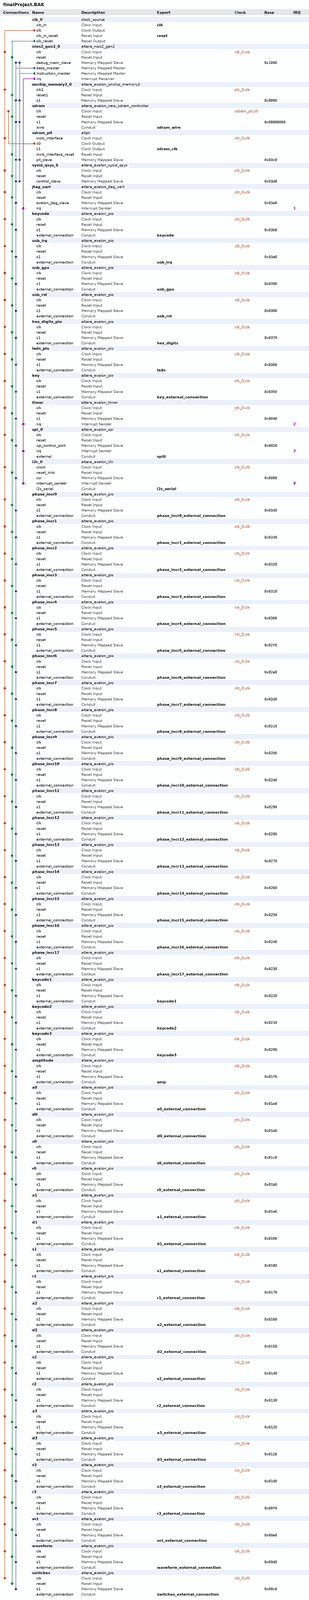
[diagram p0: system contents, whole]
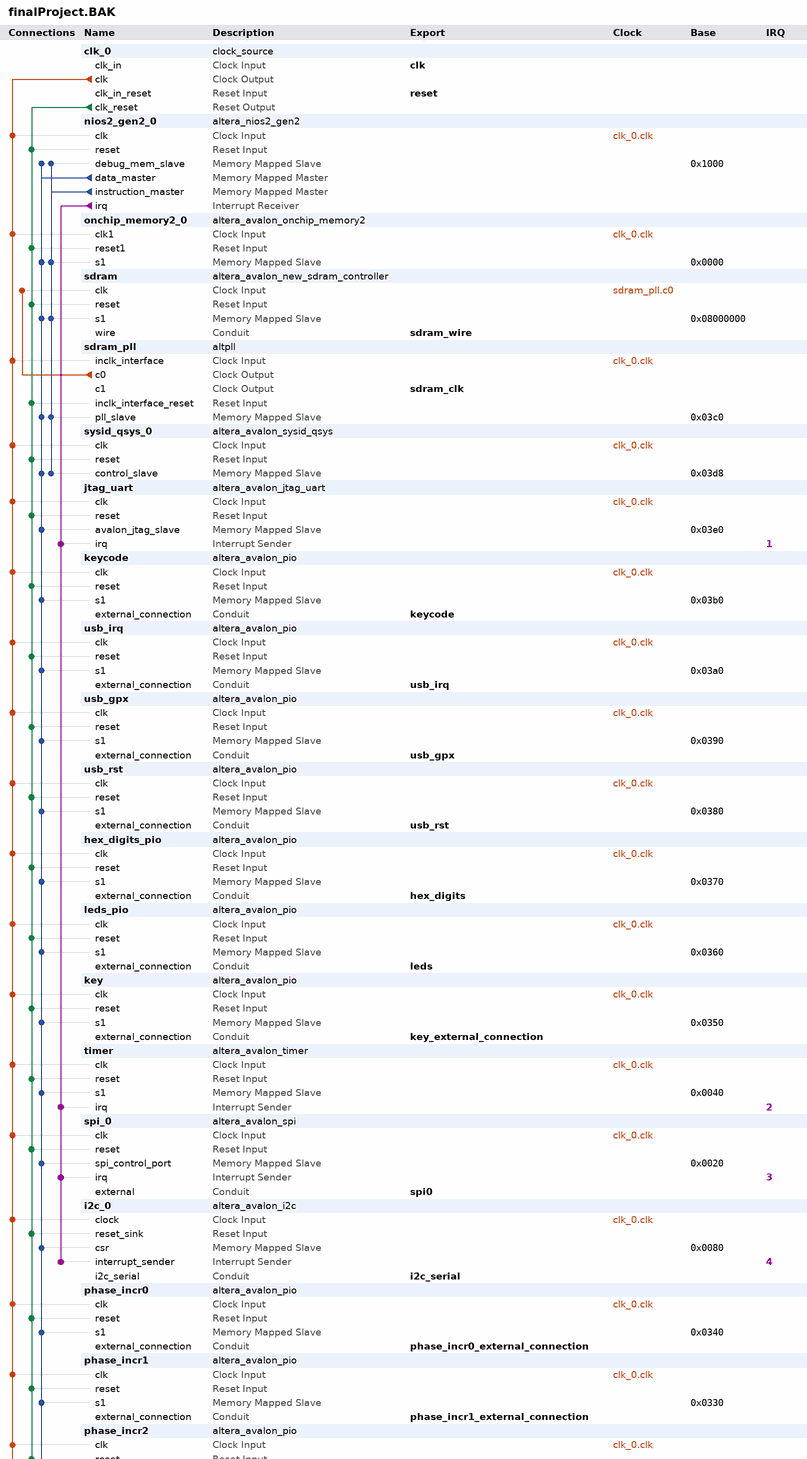
[diagram p1: system contents, upper part]
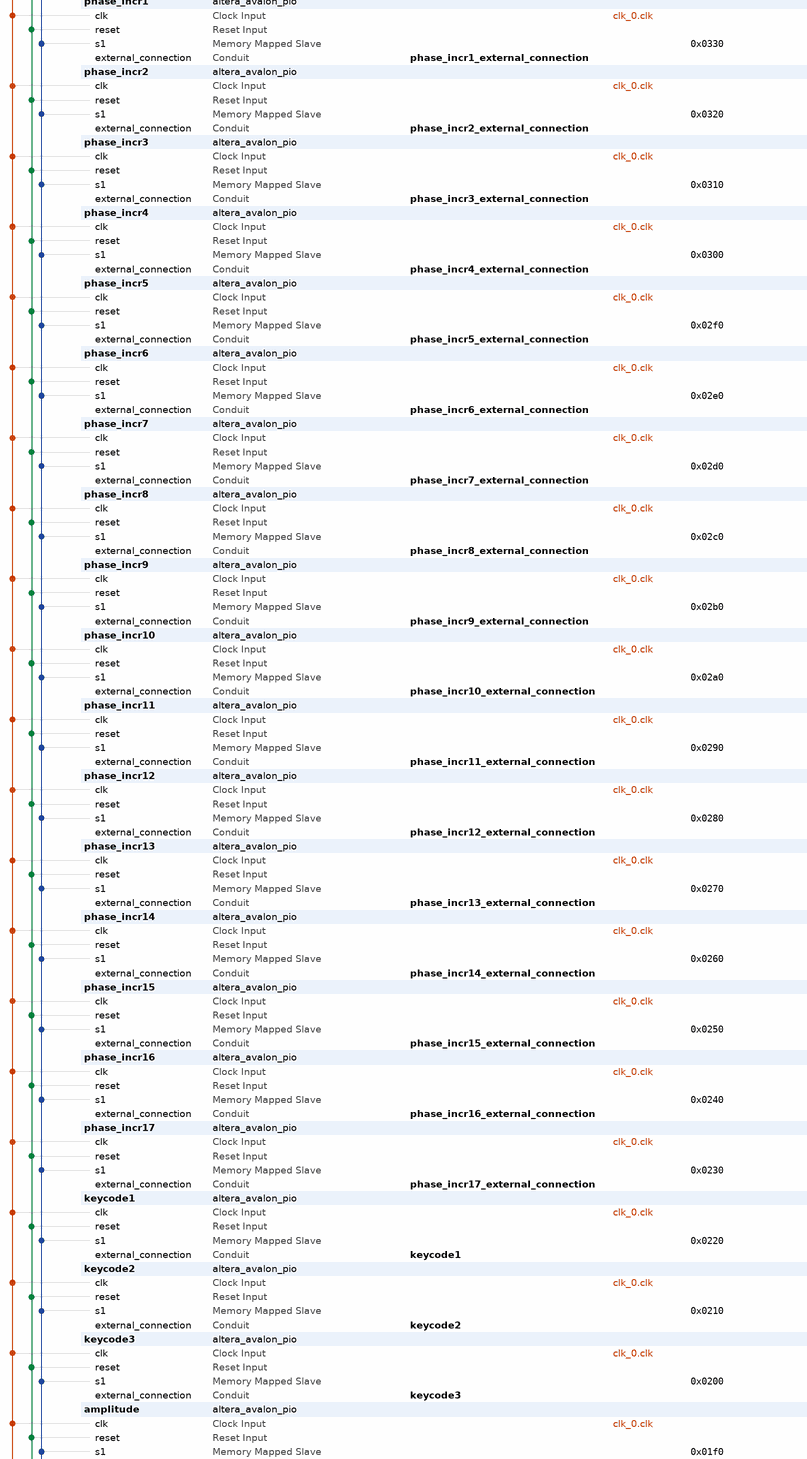
[diagram p2: system contents, middle part]
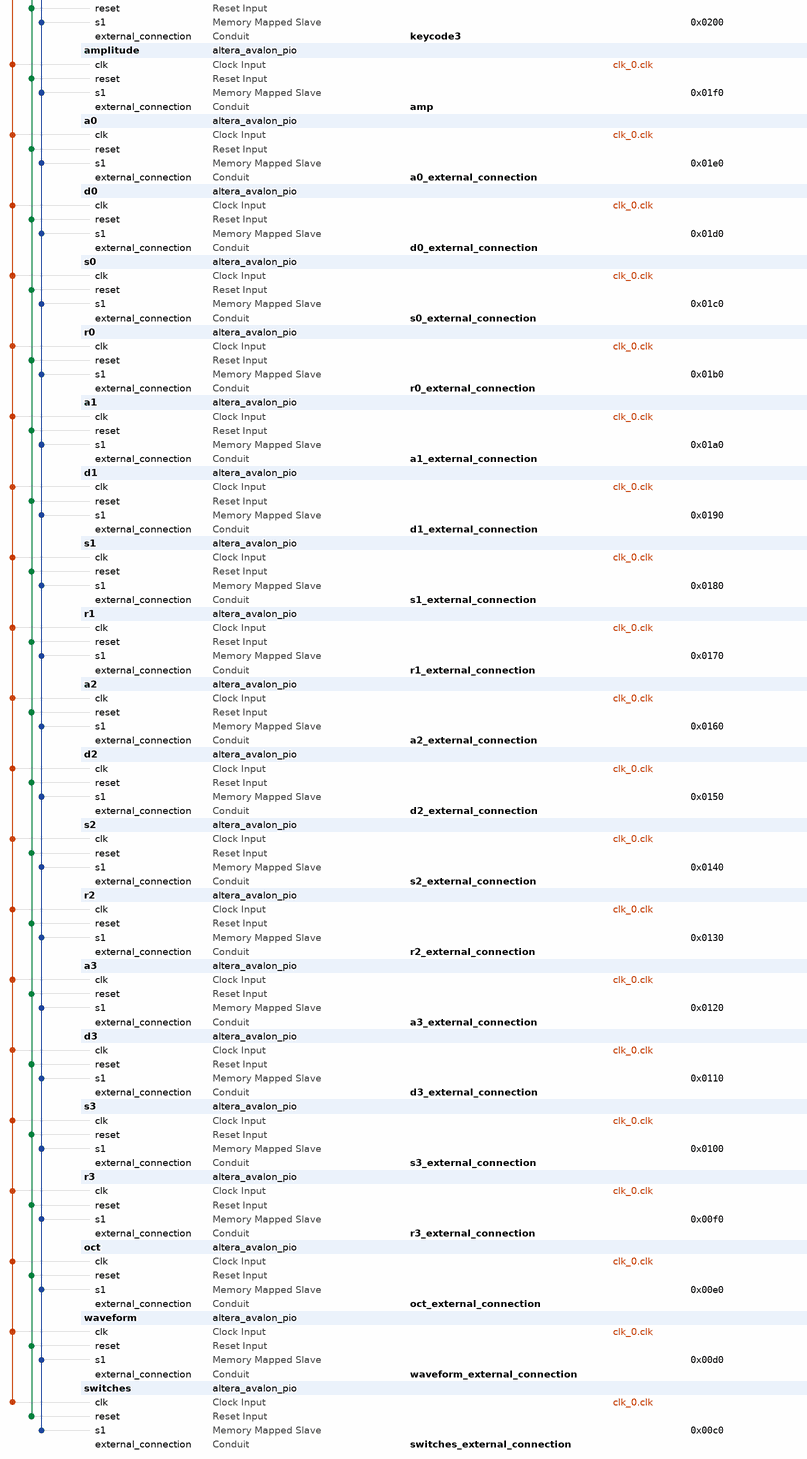
[diagram p3: system contents, lower part]
# Platform Designer (Qsys) system finalProject.BAK, MAX 10 10M50DAF484C7G
# Parameters at their usual value, and those the tool derives, are not listed.
package require -exact qsys 18.1
create_system finalProject.BAK
set_project_property DEVICE_FAMILY {MAX 10}
set_project_property DEVICE 10M50DAF484C7G

add_instance clk_0 clock_source 18.1
set_instance_parameter_value clk_0 clockFrequency 50000000

add_instance nios2_gen2_0 altera_nios2_gen2 18.1
set_instance_parameter_value nios2_gen2_0 dcache_size 2048
set_instance_parameter_value nios2_gen2_0 exceptionSlave sdram.s1
set_instance_parameter_value nios2_gen2_0 icache_size 4096
set_instance_parameter_value nios2_gen2_0 impl Tiny
set_instance_parameter_value nios2_gen2_0 resetSlave sdram.s1

add_instance onchip_memory2_0 altera_avalon_onchip_memory2 18.1
set_instance_parameter_value onchip_memory2_0 dataWidth 32
set_instance_parameter_value onchip_memory2_0 dualPort false
set_instance_parameter_value onchip_memory2_0 initMemContent true
set_instance_parameter_value onchip_memory2_0 initializationFileName onchip_mem.hex
set_instance_parameter_value onchip_memory2_0 memorySize 16

add_instance sdram altera_avalon_new_sdram_controller 18.1
set_instance_parameter_value sdram TAC 5.4
set_instance_parameter_value sdram TRCD 20.0
set_instance_parameter_value sdram TRP 20.0
set_instance_parameter_value sdram casLatency 3
set_instance_parameter_value sdram columnWidth 10
set_instance_parameter_value sdram dataWidth 16
set_instance_parameter_value sdram generateSimulationModel false
set_instance_parameter_value sdram model single_Micron_MT48LC4M32B2_7_chip
set_instance_parameter_value sdram numberOfBanks 4
set_instance_parameter_value sdram numberOfChipSelects 1
set_instance_parameter_value sdram powerUpDelay 200.0
set_instance_parameter_value sdram refreshPeriod 15.625
set_instance_parameter_value sdram rowWidth 13

add_instance sdram_pll altpll 18.1
set_instance_parameter_value sdram_pll CLK0_DIVIDE_BY 1
set_instance_parameter_value sdram_pll CLK0_MULTIPLY_BY 1
set_instance_parameter_value sdram_pll CLK1_DIVIDE_BY 1
set_instance_parameter_value sdram_pll CLK1_DUTY_CYCLE 50
set_instance_parameter_value sdram_pll CLK1_MULTIPLY_BY 1
set_instance_parameter_value sdram_pll CLK1_PHASE_SHIFT -1000
set_instance_parameter_value sdram_pll INCLK0_INPUT_FREQUENCY 20000
set_instance_parameter_value sdram_pll PORT_ARESET PORT_UNUSED
set_instance_parameter_value sdram_pll PORT_LOCKED PORT_UNUSED
set_instance_parameter_value sdram_pll PORT_clk1 PORT_USED
set_instance_parameter_value sdram_pll PORT_clk2 PORT_UNUSED
set_instance_parameter_value sdram_pll PORT_clk3 PORT_UNUSED

add_instance sysid_qsys_0 altera_avalon_sysid_qsys 18.1
set_instance_parameter_value sysid_qsys_0 id 0

add_instance jtag_uart altera_avalon_jtag_uart 18.1
set_instance_parameter_value jtag_uart simInteractiveOptions NO_INTERACTIVE_WINDOWS

add_instance keycode altera_avalon_pio 18.1
set_instance_parameter_value keycode direction Output
set_instance_parameter_value keycode width 8

add_instance usb_irq altera_avalon_pio 18.1
set_instance_parameter_value usb_irq direction Input
set_instance_parameter_value usb_irq width 1

add_instance usb_gpx altera_avalon_pio 18.1
set_instance_parameter_value usb_gpx direction Input
set_instance_parameter_value usb_gpx width 1

add_instance usb_rst altera_avalon_pio 18.1
set_instance_parameter_value usb_rst direction Output
set_instance_parameter_value usb_rst width 1

add_instance hex_digits_pio altera_avalon_pio 18.1
set_instance_parameter_value hex_digits_pio direction Output
set_instance_parameter_value hex_digits_pio width 16

add_instance leds_pio altera_avalon_pio 18.1
set_instance_parameter_value leds_pio direction Output
set_instance_parameter_value leds_pio width 14

add_instance key altera_avalon_pio 18.1
set_instance_parameter_value key direction Input
set_instance_parameter_value key width 2

add_instance timer altera_avalon_timer 18.1
set_instance_parameter_value timer counterSize 64
set_instance_parameter_value timer period 1
set_instance_parameter_value timer periodUnits MSEC

add_instance spi_0 altera_avalon_spi 18.1
set_instance_parameter_value spi_0 clockPolarity 0
set_instance_parameter_value spi_0 dataWidth 8
set_instance_parameter_value spi_0 masterSPI true
set_instance_parameter_value spi_0 numberOfSlaves 1
set_instance_parameter_value spi_0 targetClockRate 2500000

add_instance i2c_0 altera_avalon_i2c 18.1
set_instance_parameter_value i2c_0 FIFO_DEPTH 16

add_instance phase_incr0 altera_avalon_pio 18.1
set_instance_parameter_value phase_incr0 direction Output
set_instance_parameter_value phase_incr0 width 32

add_instance phase_incr1 altera_avalon_pio 18.1
set_instance_parameter_value phase_incr1 direction Output
set_instance_parameter_value phase_incr1 width 32

add_instance phase_incr2 altera_avalon_pio 18.1
set_instance_parameter_value phase_incr2 direction Output
set_instance_parameter_value phase_incr2 width 32

add_instance phase_incr3 altera_avalon_pio 18.1
set_instance_parameter_value phase_incr3 direction Output
set_instance_parameter_value phase_incr3 width 32

add_instance phase_incr4 altera_avalon_pio 18.1
set_instance_parameter_value phase_incr4 direction Output
set_instance_parameter_value phase_incr4 width 32

add_instance phase_incr5 altera_avalon_pio 18.1
set_instance_parameter_value phase_incr5 direction Output
set_instance_parameter_value phase_incr5 width 32

add_instance phase_incr6 altera_avalon_pio 18.1
set_instance_parameter_value phase_incr6 direction Output
set_instance_parameter_value phase_incr6 width 32

add_instance phase_incr7 altera_avalon_pio 18.1
set_instance_parameter_value phase_incr7 direction Output
set_instance_parameter_value phase_incr7 width 32

add_instance phase_incr8 altera_avalon_pio 18.1
set_instance_parameter_value phase_incr8 direction Output
set_instance_parameter_value phase_incr8 width 32

add_instance phase_incr9 altera_avalon_pio 18.1
set_instance_parameter_value phase_incr9 direction Output
set_instance_parameter_value phase_incr9 width 32

add_instance phase_incr10 altera_avalon_pio 18.1
set_instance_parameter_value phase_incr10 direction Output
set_instance_parameter_value phase_incr10 width 32

add_instance phase_incr11 altera_avalon_pio 18.1
set_instance_parameter_value phase_incr11 direction Output
set_instance_parameter_value phase_incr11 width 32

add_instance phase_incr12 altera_avalon_pio 18.1
set_instance_parameter_value phase_incr12 direction Output
set_instance_parameter_value phase_incr12 width 32

add_instance phase_incr13 altera_avalon_pio 18.1
set_instance_parameter_value phase_incr13 direction Output
set_instance_parameter_value phase_incr13 width 32

add_instance phase_incr14 altera_avalon_pio 18.1
set_instance_parameter_value phase_incr14 direction Output
set_instance_parameter_value phase_incr14 width 32

add_instance phase_incr15 altera_avalon_pio 18.1
set_instance_parameter_value phase_incr15 direction Output
set_instance_parameter_value phase_incr15 width 32

add_instance phase_incr16 altera_avalon_pio 18.1
set_instance_parameter_value phase_incr16 direction Output
set_instance_parameter_value phase_incr16 width 32

add_instance phase_incr17 altera_avalon_pio 18.1
set_instance_parameter_value phase_incr17 direction Output
set_instance_parameter_value phase_incr17 width 32

add_instance keycode1 altera_avalon_pio 18.1
set_instance_parameter_value keycode1 direction Output
set_instance_parameter_value keycode1 width 8

add_instance keycode2 altera_avalon_pio 18.1
set_instance_parameter_value keycode2 direction Output
set_instance_parameter_value keycode2 width 8

add_instance keycode3 altera_avalon_pio 18.1
set_instance_parameter_value keycode3 direction Output
set_instance_parameter_value keycode3 width 8

add_instance amplitude altera_avalon_pio 18.1
set_instance_parameter_value amplitude direction Output
set_instance_parameter_value amplitude width 16

add_instance a0 altera_avalon_pio 18.1
set_instance_parameter_value a0 direction Output
set_instance_parameter_value a0 width 10

add_instance d0 altera_avalon_pio 18.1
set_instance_parameter_value d0 direction Output
set_instance_parameter_value d0 width 10

add_instance s0 altera_avalon_pio 18.1
set_instance_parameter_value s0 direction Output
set_instance_parameter_value s0 width 10

add_instance r0 altera_avalon_pio 18.1
set_instance_parameter_value r0 direction Output
set_instance_parameter_value r0 width 10

add_instance a1 altera_avalon_pio 18.1
set_instance_parameter_value a1 direction Output
set_instance_parameter_value a1 width 10

add_instance d1 altera_avalon_pio 18.1
set_instance_parameter_value d1 direction Output
set_instance_parameter_value d1 width 10

add_instance s1 altera_avalon_pio 18.1
set_instance_parameter_value s1 direction Output
set_instance_parameter_value s1 width 10

add_instance r1 altera_avalon_pio 18.1
set_instance_parameter_value r1 direction Output
set_instance_parameter_value r1 width 10

add_instance a2 altera_avalon_pio 18.1
set_instance_parameter_value a2 direction Output
set_instance_parameter_value a2 width 10

add_instance d2 altera_avalon_pio 18.1
set_instance_parameter_value d2 direction Output
set_instance_parameter_value d2 width 10

add_instance s2 altera_avalon_pio 18.1
set_instance_parameter_value s2 direction Output
set_instance_parameter_value s2 width 10

add_instance r2 altera_avalon_pio 18.1
set_instance_parameter_value r2 direction Output
set_instance_parameter_value r2 width 10

add_instance a3 altera_avalon_pio 18.1
set_instance_parameter_value a3 direction Output
set_instance_parameter_value a3 width 10

add_instance d3 altera_avalon_pio 18.1
set_instance_parameter_value d3 direction Output
set_instance_parameter_value d3 width 10

add_instance s3 altera_avalon_pio 18.1
set_instance_parameter_value s3 direction Output
set_instance_parameter_value s3 width 10

add_instance r3 altera_avalon_pio 18.1
set_instance_parameter_value r3 direction Output
set_instance_parameter_value r3 width 10

add_instance oct altera_avalon_pio 18.1
set_instance_parameter_value oct direction Output
set_instance_parameter_value oct width 8

add_instance waveform altera_avalon_pio 18.1
set_instance_parameter_value waveform direction Output
set_instance_parameter_value waveform width 8

add_instance switches altera_avalon_pio 18.1
set_instance_parameter_value switches direction Input
set_instance_parameter_value switches width 10

# connections
add_connection clk_0.clk a0.clk clock
add_connection clk_0.clk a1.clk clock
add_connection clk_0.clk a2.clk clock
add_connection clk_0.clk a3.clk clock
add_connection clk_0.clk amplitude.clk clock
add_connection clk_0.clk d0.clk clock
add_connection clk_0.clk d1.clk clock
add_connection clk_0.clk d2.clk clock
add_connection clk_0.clk d3.clk clock
add_connection clk_0.clk hex_digits_pio.clk clock
add_connection clk_0.clk i2c_0.clock clock
add_connection clk_0.clk jtag_uart.clk clock
add_connection clk_0.clk key.clk clock
add_connection clk_0.clk keycode1.clk clock
add_connection clk_0.clk keycode2.clk clock
add_connection clk_0.clk keycode3.clk clock
add_connection clk_0.clk keycode.clk clock
add_connection clk_0.clk leds_pio.clk clock
add_connection clk_0.clk nios2_gen2_0.clk clock
add_connection clk_0.clk oct.clk clock
add_connection clk_0.clk onchip_memory2_0.clk1 clock
add_connection clk_0.clk phase_incr0.clk clock
add_connection clk_0.clk phase_incr1.clk clock
add_connection clk_0.clk phase_incr2.clk clock
add_connection clk_0.clk phase_incr3.clk clock
add_connection clk_0.clk phase_incr4.clk clock
add_connection clk_0.clk phase_incr5.clk clock
add_connection clk_0.clk phase_incr6.clk clock
add_connection clk_0.clk phase_incr7.clk clock
add_connection clk_0.clk phase_incr8.clk clock
add_connection clk_0.clk phase_incr9.clk clock
add_connection clk_0.clk phase_incr10.clk clock
add_connection clk_0.clk phase_incr11.clk clock
add_connection clk_0.clk phase_incr12.clk clock
add_connection clk_0.clk phase_incr13.clk clock
add_connection clk_0.clk phase_incr14.clk clock
add_connection clk_0.clk phase_incr15.clk clock
add_connection clk_0.clk phase_incr16.clk clock
add_connection clk_0.clk phase_incr17.clk clock
add_connection clk_0.clk r0.clk clock
add_connection clk_0.clk r1.clk clock
add_connection clk_0.clk r2.clk clock
add_connection clk_0.clk r3.clk clock
add_connection clk_0.clk s0.clk clock
add_connection clk_0.clk s1.clk clock
add_connection clk_0.clk s2.clk clock
add_connection clk_0.clk s3.clk clock
add_connection clk_0.clk sdram_pll.inclk_interface clock
add_connection clk_0.clk spi_0.clk clock
add_connection clk_0.clk switches.clk clock
add_connection clk_0.clk sysid_qsys_0.clk clock
add_connection clk_0.clk timer.clk clock
add_connection clk_0.clk usb_gpx.clk clock
add_connection clk_0.clk usb_irq.clk clock
add_connection clk_0.clk usb_rst.clk clock
add_connection clk_0.clk waveform.clk clock
add_connection sdram_pll.c0 sdram.clk clock
add_connection clk_0.clk_reset a0.reset reset
add_connection clk_0.clk_reset a1.reset reset
add_connection clk_0.clk_reset a2.reset reset
add_connection clk_0.clk_reset a3.reset reset
add_connection clk_0.clk_reset amplitude.reset reset
add_connection clk_0.clk_reset d0.reset reset
add_connection clk_0.clk_reset d1.reset reset
add_connection clk_0.clk_reset d2.reset reset
add_connection clk_0.clk_reset d3.reset reset
add_connection clk_0.clk_reset hex_digits_pio.reset reset
add_connection clk_0.clk_reset i2c_0.reset_sink reset
add_connection clk_0.clk_reset jtag_uart.reset reset
add_connection clk_0.clk_reset key.reset reset
add_connection clk_0.clk_reset keycode1.reset reset
add_connection clk_0.clk_reset keycode2.reset reset
add_connection clk_0.clk_reset keycode3.reset reset
add_connection clk_0.clk_reset keycode.reset reset
add_connection clk_0.clk_reset leds_pio.reset reset
add_connection clk_0.clk_reset nios2_gen2_0.reset reset
add_connection clk_0.clk_reset oct.reset reset
add_connection clk_0.clk_reset onchip_memory2_0.reset1 reset
add_connection clk_0.clk_reset phase_incr0.reset reset
add_connection clk_0.clk_reset phase_incr1.reset reset
add_connection clk_0.clk_reset phase_incr2.reset reset
add_connection clk_0.clk_reset phase_incr3.reset reset
add_connection clk_0.clk_reset phase_incr4.reset reset
add_connection clk_0.clk_reset phase_incr5.reset reset
add_connection clk_0.clk_reset phase_incr6.reset reset
add_connection clk_0.clk_reset phase_incr7.reset reset
add_connection clk_0.clk_reset phase_incr8.reset reset
add_connection clk_0.clk_reset phase_incr9.reset reset
add_connection clk_0.clk_reset phase_incr10.reset reset
add_connection clk_0.clk_reset phase_incr11.reset reset
add_connection clk_0.clk_reset phase_incr12.reset reset
add_connection clk_0.clk_reset phase_incr13.reset reset
add_connection clk_0.clk_reset phase_incr14.reset reset
add_connection clk_0.clk_reset phase_incr15.reset reset
add_connection clk_0.clk_reset phase_incr16.reset reset
add_connection clk_0.clk_reset phase_incr17.reset reset
add_connection clk_0.clk_reset r0.reset reset
add_connection clk_0.clk_reset r1.reset reset
add_connection clk_0.clk_reset r2.reset reset
add_connection clk_0.clk_reset r3.reset reset
add_connection clk_0.clk_reset s0.reset reset
add_connection clk_0.clk_reset s1.reset reset
add_connection clk_0.clk_reset s2.reset reset
add_connection clk_0.clk_reset s3.reset reset
add_connection clk_0.clk_reset sdram.reset reset
add_connection clk_0.clk_reset sdram_pll.inclk_interface_reset reset
add_connection clk_0.clk_reset spi_0.reset reset
add_connection clk_0.clk_reset switches.reset reset
add_connection clk_0.clk_reset sysid_qsys_0.reset reset
add_connection clk_0.clk_reset timer.reset reset
add_connection clk_0.clk_reset usb_gpx.reset reset
add_connection clk_0.clk_reset usb_irq.reset reset
add_connection clk_0.clk_reset usb_rst.reset reset
add_connection clk_0.clk_reset waveform.reset reset
add_connection nios2_gen2_0.data_master a0.s1 avalon
set_connection_parameter_value nios2_gen2_0.data_master/a0.s1 baseAddress 0x01e0
add_connection nios2_gen2_0.data_master a1.s1 avalon
set_connection_parameter_value nios2_gen2_0.data_master/a1.s1 baseAddress 0x01a0
add_connection nios2_gen2_0.data_master a2.s1 avalon
set_connection_parameter_value nios2_gen2_0.data_master/a2.s1 baseAddress 0x0160
add_connection nios2_gen2_0.data_master a3.s1 avalon
set_connection_parameter_value nios2_gen2_0.data_master/a3.s1 baseAddress 0x0120
add_connection nios2_gen2_0.data_master amplitude.s1 avalon
set_connection_parameter_value nios2_gen2_0.data_master/amplitude.s1 baseAddress 0x01f0
add_connection nios2_gen2_0.data_master d0.s1 avalon
set_connection_parameter_value nios2_gen2_0.data_master/d0.s1 baseAddress 0x01d0
add_connection nios2_gen2_0.data_master d1.s1 avalon
set_connection_parameter_value nios2_gen2_0.data_master/d1.s1 baseAddress 0x0190
add_connection nios2_gen2_0.data_master d2.s1 avalon
set_connection_parameter_value nios2_gen2_0.data_master/d2.s1 baseAddress 0x0150
add_connection nios2_gen2_0.data_master d3.s1 avalon
set_connection_parameter_value nios2_gen2_0.data_master/d3.s1 baseAddress 0x0110
add_connection nios2_gen2_0.data_master hex_digits_pio.s1 avalon
set_connection_parameter_value nios2_gen2_0.data_master/hex_digits_pio.s1 baseAddress 0x0370
add_connection nios2_gen2_0.data_master i2c_0.csr avalon
set_connection_parameter_value nios2_gen2_0.data_master/i2c_0.csr baseAddress 0x0080
add_connection nios2_gen2_0.data_master jtag_uart.avalon_jtag_slave avalon
set_connection_parameter_value nios2_gen2_0.data_master/jtag_uart.avalon_jtag_slave baseAddress 0x03e0
add_connection nios2_gen2_0.data_master key.s1 avalon
set_connection_parameter_value nios2_gen2_0.data_master/key.s1 baseAddress 0x0350
add_connection nios2_gen2_0.data_master keycode1.s1 avalon
set_connection_parameter_value nios2_gen2_0.data_master/keycode1.s1 baseAddress 0x0220
add_connection nios2_gen2_0.data_master keycode2.s1 avalon
set_connection_parameter_value nios2_gen2_0.data_master/keycode2.s1 baseAddress 0x0210
add_connection nios2_gen2_0.data_master keycode3.s1 avalon
set_connection_parameter_value nios2_gen2_0.data_master/keycode3.s1 baseAddress 0x0200
add_connection nios2_gen2_0.data_master keycode.s1 avalon
set_connection_parameter_value nios2_gen2_0.data_master/keycode.s1 baseAddress 0x03b0
add_connection nios2_gen2_0.data_master leds_pio.s1 avalon
set_connection_parameter_value nios2_gen2_0.data_master/leds_pio.s1 baseAddress 0x0360
add_connection nios2_gen2_0.data_master nios2_gen2_0.debug_mem_slave avalon
set_connection_parameter_value nios2_gen2_0.data_master/nios2_gen2_0.debug_mem_slave baseAddress 0x1000
add_connection nios2_gen2_0.data_master oct.s1 avalon
set_connection_parameter_value nios2_gen2_0.data_master/oct.s1 baseAddress 0x00e0
add_connection nios2_gen2_0.data_master onchip_memory2_0.s1 avalon
set_connection_parameter_value nios2_gen2_0.data_master/onchip_memory2_0.s1 baseAddress 0x0000
add_connection nios2_gen2_0.data_master phase_incr0.s1 avalon
set_connection_parameter_value nios2_gen2_0.data_master/phase_incr0.s1 baseAddress 0x0340
add_connection nios2_gen2_0.data_master phase_incr1.s1 avalon
set_connection_parameter_value nios2_gen2_0.data_master/phase_incr1.s1 baseAddress 0x0330
add_connection nios2_gen2_0.data_master phase_incr2.s1 avalon
set_connection_parameter_value nios2_gen2_0.data_master/phase_incr2.s1 baseAddress 0x0320
add_connection nios2_gen2_0.data_master phase_incr3.s1 avalon
set_connection_parameter_value nios2_gen2_0.data_master/phase_incr3.s1 baseAddress 0x0310
add_connection nios2_gen2_0.data_master phase_incr4.s1 avalon
set_connection_parameter_value nios2_gen2_0.data_master/phase_incr4.s1 baseAddress 0x0300
add_connection nios2_gen2_0.data_master phase_incr5.s1 avalon
set_connection_parameter_value nios2_gen2_0.data_master/phase_incr5.s1 baseAddress 0x02f0
add_connection nios2_gen2_0.data_master phase_incr6.s1 avalon
set_connection_parameter_value nios2_gen2_0.data_master/phase_incr6.s1 baseAddress 0x02e0
add_connection nios2_gen2_0.data_master phase_incr7.s1 avalon
set_connection_parameter_value nios2_gen2_0.data_master/phase_incr7.s1 baseAddress 0x02d0
add_connection nios2_gen2_0.data_master phase_incr8.s1 avalon
set_connection_parameter_value nios2_gen2_0.data_master/phase_incr8.s1 baseAddress 0x02c0
add_connection nios2_gen2_0.data_master phase_incr9.s1 avalon
set_connection_parameter_value nios2_gen2_0.data_master/phase_incr9.s1 baseAddress 0x02b0
add_connection nios2_gen2_0.data_master phase_incr10.s1 avalon
set_connection_parameter_value nios2_gen2_0.data_master/phase_incr10.s1 baseAddress 0x02a0
add_connection nios2_gen2_0.data_master phase_incr11.s1 avalon
set_connection_parameter_value nios2_gen2_0.data_master/phase_incr11.s1 baseAddress 0x0290
add_connection nios2_gen2_0.data_master phase_incr12.s1 avalon
set_connection_parameter_value nios2_gen2_0.data_master/phase_incr12.s1 baseAddress 0x0280
add_connection nios2_gen2_0.data_master phase_incr13.s1 avalon
set_connection_parameter_value nios2_gen2_0.data_master/phase_incr13.s1 baseAddress 0x0270
add_connection nios2_gen2_0.data_master phase_incr14.s1 avalon
set_connection_parameter_value nios2_gen2_0.data_master/phase_incr14.s1 baseAddress 0x0260
add_connection nios2_gen2_0.data_master phase_incr15.s1 avalon
set_connection_parameter_value nios2_gen2_0.data_master/phase_incr15.s1 baseAddress 0x0250
add_connection nios2_gen2_0.data_master phase_incr16.s1 avalon
set_connection_parameter_value nios2_gen2_0.data_master/phase_incr16.s1 baseAddress 0x0240
add_connection nios2_gen2_0.data_master phase_incr17.s1 avalon
set_connection_parameter_value nios2_gen2_0.data_master/phase_incr17.s1 baseAddress 0x0230
add_connection nios2_gen2_0.data_master r0.s1 avalon
set_connection_parameter_value nios2_gen2_0.data_master/r0.s1 baseAddress 0x01b0
add_connection nios2_gen2_0.data_master r1.s1 avalon
set_connection_parameter_value nios2_gen2_0.data_master/r1.s1 baseAddress 0x0170
add_connection nios2_gen2_0.data_master r2.s1 avalon
set_connection_parameter_value nios2_gen2_0.data_master/r2.s1 baseAddress 0x0130
add_connection nios2_gen2_0.data_master r3.s1 avalon
set_connection_parameter_value nios2_gen2_0.data_master/r3.s1 baseAddress 0x00f0
add_connection nios2_gen2_0.data_master s0.s1 avalon
set_connection_parameter_value nios2_gen2_0.data_master/s0.s1 baseAddress 0x01c0
add_connection nios2_gen2_0.data_master s1.s1 avalon
set_connection_parameter_value nios2_gen2_0.data_master/s1.s1 baseAddress 0x0180
add_connection nios2_gen2_0.data_master s2.s1 avalon
set_connection_parameter_value nios2_gen2_0.data_master/s2.s1 baseAddress 0x0140
add_connection nios2_gen2_0.data_master s3.s1 avalon
set_connection_parameter_value nios2_gen2_0.data_master/s3.s1 baseAddress 0x0100
add_connection nios2_gen2_0.data_master sdram.s1 avalon
set_connection_parameter_value nios2_gen2_0.data_master/sdram.s1 baseAddress 0x08000000
add_connection nios2_gen2_0.data_master sdram_pll.pll_slave avalon
set_connection_parameter_value nios2_gen2_0.data_master/sdram_pll.pll_slave baseAddress 0x03c0
add_connection nios2_gen2_0.data_master spi_0.spi_control_port avalon
set_connection_parameter_value nios2_gen2_0.data_master/spi_0.spi_control_port baseAddress 0x0020
add_connection nios2_gen2_0.data_master switches.s1 avalon
set_connection_parameter_value nios2_gen2_0.data_master/switches.s1 baseAddress 0x00c0
add_connection nios2_gen2_0.data_master sysid_qsys_0.control_slave avalon
set_connection_parameter_value nios2_gen2_0.data_master/sysid_qsys_0.control_slave baseAddress 0x03d8
add_connection nios2_gen2_0.data_master timer.s1 avalon
set_connection_parameter_value nios2_gen2_0.data_master/timer.s1 baseAddress 0x0040
add_connection nios2_gen2_0.data_master usb_gpx.s1 avalon
set_connection_parameter_value nios2_gen2_0.data_master/usb_gpx.s1 baseAddress 0x0390
add_connection nios2_gen2_0.data_master usb_irq.s1 avalon
set_connection_parameter_value nios2_gen2_0.data_master/usb_irq.s1 baseAddress 0x03a0
add_connection nios2_gen2_0.data_master usb_rst.s1 avalon
set_connection_parameter_value nios2_gen2_0.data_master/usb_rst.s1 baseAddress 0x0380
add_connection nios2_gen2_0.data_master waveform.s1 avalon
set_connection_parameter_value nios2_gen2_0.data_master/waveform.s1 baseAddress 0x00d0
add_connection nios2_gen2_0.instruction_master nios2_gen2_0.debug_mem_slave avalon
set_connection_parameter_value nios2_gen2_0.instruction_master/nios2_gen2_0.debug_mem_slave baseAddress 0x1000
add_connection nios2_gen2_0.instruction_master onchip_memory2_0.s1 avalon
set_connection_parameter_value nios2_gen2_0.instruction_master/onchip_memory2_0.s1 baseAddress 0x0000
add_connection nios2_gen2_0.instruction_master sdram.s1 avalon
set_connection_parameter_value nios2_gen2_0.instruction_master/sdram.s1 baseAddress 0x08000000
add_connection nios2_gen2_0.instruction_master sdram_pll.pll_slave avalon
set_connection_parameter_value nios2_gen2_0.instruction_master/sdram_pll.pll_slave baseAddress 0x03c0
add_connection nios2_gen2_0.instruction_master sysid_qsys_0.control_slave avalon
set_connection_parameter_value nios2_gen2_0.instruction_master/sysid_qsys_0.control_slave baseAddress 0x03d8
add_connection nios2_gen2_0.irq i2c_0.interrupt_sender interrupt
set_connection_parameter_value nios2_gen2_0.irq/i2c_0.interrupt_sender irqNumber 4
add_connection nios2_gen2_0.irq jtag_uart.irq interrupt
set_connection_parameter_value nios2_gen2_0.irq/jtag_uart.irq irqNumber 1
add_connection nios2_gen2_0.irq spi_0.irq interrupt
set_connection_parameter_value nios2_gen2_0.irq/spi_0.irq irqNumber 3
add_connection nios2_gen2_0.irq timer.irq interrupt
set_connection_parameter_value nios2_gen2_0.irq/timer.irq irqNumber 2

# exported interfaces
add_interface a0_external_connection conduit end
set_interface_property a0_external_connection EXPORT_OF a0.external_connection
add_interface a1_external_connection conduit end
set_interface_property a1_external_connection EXPORT_OF a1.external_connection
add_interface a2_external_connection conduit end
set_interface_property a2_external_connection EXPORT_OF a2.external_connection
add_interface a3_external_connection conduit end
set_interface_property a3_external_connection EXPORT_OF a3.external_connection
add_interface amp conduit end
set_interface_property amp EXPORT_OF amplitude.external_connection
add_interface clk clock sink
set_interface_property clk EXPORT_OF clk_0.clk_in
add_interface d0_external_connection conduit end
set_interface_property d0_external_connection EXPORT_OF d0.external_connection
add_interface d1_external_connection conduit end
set_interface_property d1_external_connection EXPORT_OF d1.external_connection
add_interface d2_external_connection conduit end
set_interface_property d2_external_connection EXPORT_OF d2.external_connection
add_interface d3_external_connection conduit end
set_interface_property d3_external_connection EXPORT_OF d3.external_connection
add_interface hex_digits conduit end
set_interface_property hex_digits EXPORT_OF hex_digits_pio.external_connection
add_interface i2c_serial conduit end
set_interface_property i2c_serial EXPORT_OF i2c_0.i2c_serial
add_interface key_external_connection conduit end
set_interface_property key_external_connection EXPORT_OF key.external_connection
add_interface keycode conduit end
set_interface_property keycode EXPORT_OF keycode.external_connection
add_interface keycode1 conduit end
set_interface_property keycode1 EXPORT_OF keycode1.external_connection
add_interface keycode2 conduit end
set_interface_property keycode2 EXPORT_OF keycode2.external_connection
add_interface keycode3 conduit end
set_interface_property keycode3 EXPORT_OF keycode3.external_connection
add_interface leds conduit end
set_interface_property leds EXPORT_OF leds_pio.external_connection
add_interface oct_external_connection conduit end
set_interface_property oct_external_connection EXPORT_OF oct.external_connection
add_interface phase_incr0_external_connection conduit end
set_interface_property phase_incr0_external_connection EXPORT_OF phase_incr0.external_connection
add_interface phase_incr10_external_connection conduit end
set_interface_property phase_incr10_external_connection EXPORT_OF phase_incr10.external_connection
add_interface phase_incr11_external_connection conduit end
set_interface_property phase_incr11_external_connection EXPORT_OF phase_incr11.external_connection
add_interface phase_incr12_external_connection conduit end
set_interface_property phase_incr12_external_connection EXPORT_OF phase_incr12.external_connection
add_interface phase_incr13_external_connection conduit end
set_interface_property phase_incr13_external_connection EXPORT_OF phase_incr13.external_connection
add_interface phase_incr14_external_connection conduit end
set_interface_property phase_incr14_external_connection EXPORT_OF phase_incr14.external_connection
add_interface phase_incr15_external_connection conduit end
set_interface_property phase_incr15_external_connection EXPORT_OF phase_incr15.external_connection
add_interface phase_incr16_external_connection conduit end
set_interface_property phase_incr16_external_connection EXPORT_OF phase_incr16.external_connection
add_interface phase_incr17_external_connection conduit end
set_interface_property phase_incr17_external_connection EXPORT_OF phase_incr17.external_connection
add_interface phase_incr1_external_connection conduit end
set_interface_property phase_incr1_external_connection EXPORT_OF phase_incr1.external_connection
add_interface phase_incr2_external_connection conduit end
set_interface_property phase_incr2_external_connection EXPORT_OF phase_incr2.external_connection
add_interface phase_incr3_external_connection conduit end
set_interface_property phase_incr3_external_connection EXPORT_OF phase_incr3.external_connection
add_interface phase_incr4_external_connection conduit end
set_interface_property phase_incr4_external_connection EXPORT_OF phase_incr4.external_connection
add_interface phase_incr5_external_connection conduit end
set_interface_property phase_incr5_external_connection EXPORT_OF phase_incr5.external_connection
add_interface phase_incr6_external_connection conduit end
set_interface_property phase_incr6_external_connection EXPORT_OF phase_incr6.external_connection
add_interface phase_incr7_external_connection conduit end
set_interface_property phase_incr7_external_connection EXPORT_OF phase_incr7.external_connection
add_interface phase_incr8_external_connection conduit end
set_interface_property phase_incr8_external_connection EXPORT_OF phase_incr8.external_connection
add_interface phase_incr9_external_connection conduit end
set_interface_property phase_incr9_external_connection EXPORT_OF phase_incr9.external_connection
add_interface r0_external_connection conduit end
set_interface_property r0_external_connection EXPORT_OF r0.external_connection
add_interface r1_external_connection conduit end
set_interface_property r1_external_connection EXPORT_OF r1.external_connection
add_interface r2_external_connection conduit end
set_interface_property r2_external_connection EXPORT_OF r2.external_connection
add_interface r3_external_connection conduit end
set_interface_property r3_external_connection EXPORT_OF r3.external_connection
add_interface reset reset sink
set_interface_property reset EXPORT_OF clk_0.clk_in_reset
add_interface s0_external_connection conduit end
set_interface_property s0_external_connection EXPORT_OF s0.external_connection
add_interface s1_external_connection conduit end
set_interface_property s1_external_connection EXPORT_OF s1.external_connection
add_interface s2_external_connection conduit end
set_interface_property s2_external_connection EXPORT_OF s2.external_connection
add_interface s3_external_connection conduit end
set_interface_property s3_external_connection EXPORT_OF s3.external_connection
add_interface sdram_clk clock source
set_interface_property sdram_clk EXPORT_OF sdram_pll.c1
add_interface sdram_wire conduit end
set_interface_property sdram_wire EXPORT_OF sdram.wire
add_interface spi0 conduit end
set_interface_property spi0 EXPORT_OF spi_0.external
add_interface switches_external_connection conduit end
set_interface_property switches_external_connection EXPORT_OF switches.external_connection
add_interface usb_gpx conduit end
set_interface_property usb_gpx EXPORT_OF usb_gpx.external_connection
add_interface usb_irq conduit end
set_interface_property usb_irq EXPORT_OF usb_irq.external_connection
add_interface usb_rst conduit end
set_interface_property usb_rst EXPORT_OF usb_rst.external_connection
add_interface waveform_external_connection conduit end
set_interface_property waveform_external_connection EXPORT_OF waveform.external_connection

set_interconnect_requirement {$system} qsys_mm.clockCrossingAdapter HANDSHAKE
set_interconnect_requirement {$system} qsys_mm.enableEccProtection FALSE
set_interconnect_requirement {$system} qsys_mm.insertDefaultSlave FALSE
set_interconnect_requirement {$system} qsys_mm.maxAdditionalLatency 1

save_system finalProject.BAK.qsys
